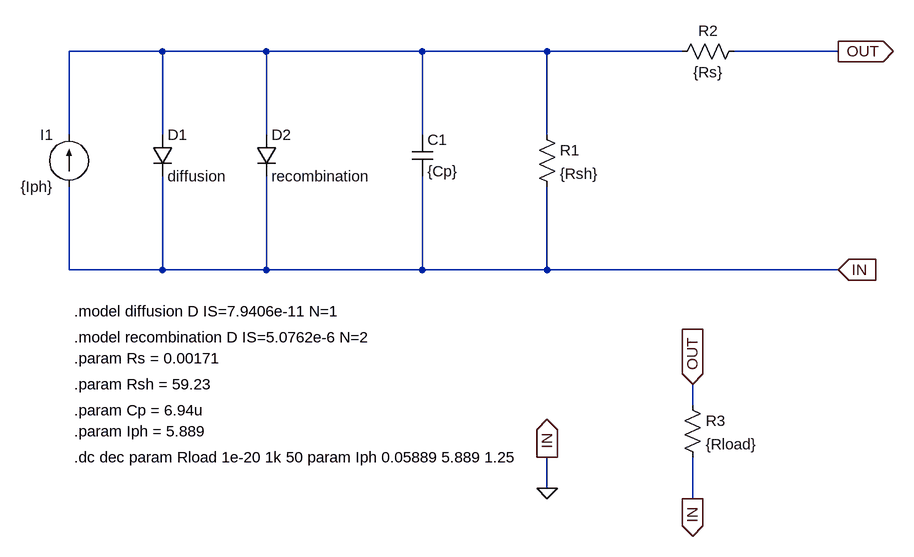
[diagram p0: schematic jac--m5sf-2.asc]
jac--m5sf-2.asc, the LTspice schematic file:
Version 4
SHEET 1 1300 784
WIRE 144 -16 0 -16
WIRE 304 -16 144 -16
WIRE 544 -16 304 -16
WIRE 736 -16 544 -16
WIRE 944 -16 736 -16
WIRE 1184 -16 1024 -16
WIRE 0 112 0 -16
WIRE 144 112 144 -16
WIRE 304 112 304 -16
WIRE 544 112 544 -16
WIRE 736 112 736 -16
WIRE 0 320 0 192
WIRE 144 320 144 176
WIRE 144 320 0 320
WIRE 304 320 304 176
WIRE 304 320 144 320
WIRE 544 320 544 176
WIRE 544 320 304 320
WIRE 736 320 736 192
WIRE 736 320 544 320
WIRE 1184 320 736 320
WIRE 960 528 960 496
WIRE 736 656 736 608
WIRE 960 672 960 608
FLAG 1184 320 IN
IOPIN 1184 320 In
FLAG 1184 -16 OUT
IOPIN 1184 -16 Out
FLAG 960 672 IN
IOPIN 960 672 Out
FLAG 960 496 OUT
IOPIN 960 496 In
FLAG 736 656 0
FLAG 736 608 IN
IOPIN 736 608 Out
SYMBOL current 0 192 R180
WINDOW 0 24 80 Left 2
WINDOW 3 24 0 Left 2
SYMATTR InstName I1
SYMATTR Value {Iph}
SYMBOL diode 128 112 R0
SYMATTR InstName D1
SYMATTR Value diffusion
SYMBOL diode 288 112 R0
SYMATTR InstName D2
SYMATTR Value recombination
SYMBOL cap 528 112 R0
SYMATTR InstName C1
SYMATTR Value {Cp}
SYMBOL res 720 96 R0
SYMATTR InstName R1
SYMATTR Value {Rsh}
SYMBOL res 928 0 R270
WINDOW 0 32 56 VTop 2
WINDOW 3 0 56 VBottom 2
SYMATTR InstName R2
SYMATTR Value {Rs}
SYMBOL res 944 512 R0
SYMATTR InstName R3
SYMATTR Value {Rload}
TEXT 8 384 Left 2 !.model diffusion D IS=7.9406e-11 N=1
TEXT 8 424 Left 2 !.model recombination D IS=5.0762e-6 N=2
TEXT 8 456 Left 2 !.param Rs = 0.00171
TEXT 8 496 Left 2 !.param Rsh = 59.23
TEXT 8 536 Left 2 !.param Cp = 6.94u
TEXT 8 568 Left 2 !.param Iph = 5.889
TEXT 8 608 Left 2 !.dc dec param Rload 1e-20 1k 50 param Iph 0.05889 5.889 1.25

The netlist it stands for:
* jac--m5sf-2.asc
I1 0 N001 {Iph}
D1 N001 0 diffusion
D2 N001 0 recombination
C1 N001 0 {Cp}
R1 N001 0 {Rsh}
R2 N001 OUT {Rs}
R3 OUT 0 {Rload}
.model D D
.lib standard.dio
.model diffusion D IS=7.9406e-11 N=1
.model recombination D IS=5.0762e-6 N=2
.param Rs = 0.00171
.param Rsh = 59.23
.param Cp = 6.94u
.param Iph = 5.889
.dc dec param Rload 1e-20 1k 50 param Iph 0.05889 5.889 1.25
.backanno
.end